# Altium schematic sheet IMU-SENSOR.schdoc
size 145 x 104 mm
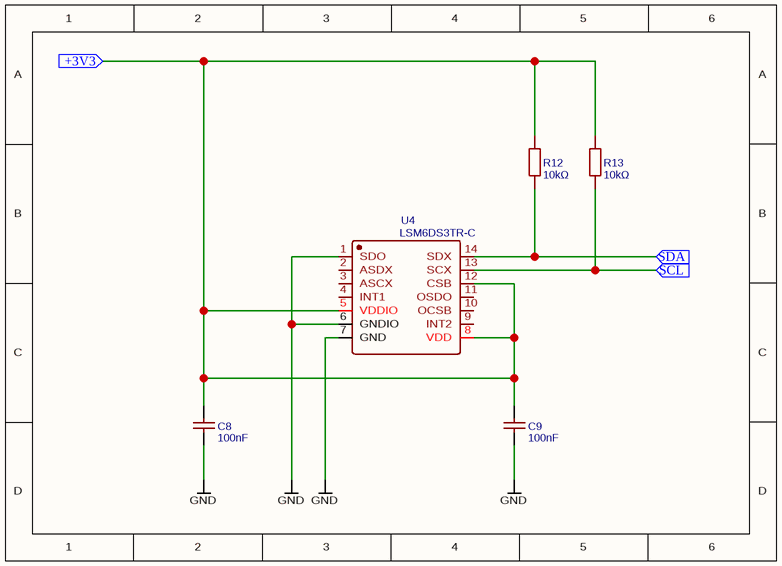
[diagram p0: IMU-SENSOR.schdoc]

## Parts
C8  100nF  [C0603]
C9  100nF  [C0603]
R12  10kΩ  [R0603]
R13  10kΩ  [R0603]
U4  LSM6DS3TR-C  [LGA-14_L3.0-W2.5-P0.50-BL]

## Ports
+3V3 (in), SCL (in), SDA (in)

## Nets
GND: C8.1 C9.1 U4.1(SDO) U4.6(GNDIO) U4.7(GND)
+3V3: C8.2 C9.2 R12.2 R13.2 U4.5(VDDIO) U4.8(VDD) U4.12(CSB) ; port +3V3
SCL: R13.1 U4.13(SCX) ; port SCL
SDA: R12.1 U4.14(SDX) ; port SDA

Not connected (* = marked no-connect by the designer): U4 2(ASDX) 3(ASCX) 4(INT1) 9(INT2) 10(OCSB) 11(OSDO)

## Library data of the parts
C8 C9 = 100nF: BOM_Manufacturer: SAMSUNG; BOM_Manufacturer Part: CL10B104KO8NNNC; nameAlias: Capacitance; BOM_Supplier: LCSC; BOM_Supplier Part: C66501; BOM_JLCPCB Part Class: Extended Part; spicePre: C; spiceSymbolName: CL10B104KO8NNNC
R12 R13 = 10kΩ: BOM_Manufacturer: Guangdong Fenghua Advanced Tech; BOM_Manufacturer Part: RS-03K1002FT; Resistance (Ohms): 10K; nameAlias: Resistance; Contributor: LCSC; BOM_Supplier: LCSC; BOM_Supplier Part: C115324; BOM_JLCPCB Part Class: Extended Part; spicePre: R; spiceSymbolName: RS-03K1002FT
U4 = LSM6DS3TR-C: BOM_Manufacturer: STMicroelectronics; BOM_Supplier: LCSC; BOM_Manufacturer Part: LSM6DS3TR-C; BOM_Supplier Part: C967633; BOM_JLCPCB Part Class: Extended Part; spicePre: U; spiceSymbolName: BMI160